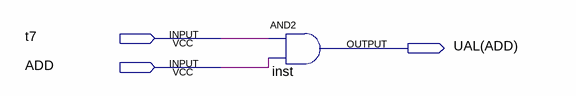
[diagram p0: schematic sheet]
// Quartus schematic UAL(ADD).bdf as structural Verilog: 1 symbols, 3 pins
module \UAL(ADD)  (
  input  t7,
  input  ADD,
  output \UAL(ADD) 
);

  and inst (\UAL(ADD) , t7, ADD);
endmodule
